# EAGLE design board_v1 (EAGLE 8.5.0)
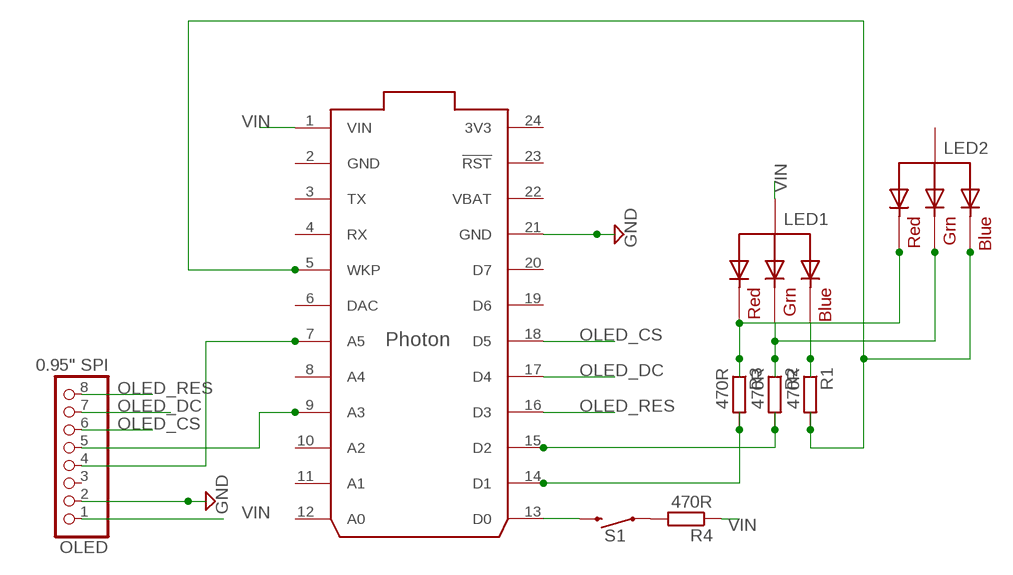
[diagram p0: schematic, sheet 1]

## Parts
LED1  RGBLED_CA-5MM  [LED5MMRGB]
LED2  RGBLED_CA-5MM  [LED5MMRGB]
OLED  0.95" SPI  PINHD-1X8/90  [1X08/90]
R1  470R  R0204/7  [0204/7]
R2  470R  R0204/7  [0204/7]
R3  470R  R0204/7  [0204/7]
R4  470R  R0204/7  [0204/7]
S1  MOMENTARY-SWITCH-SPST-PTH-12MM  [TACTILE_SWITCH_PTH_12MM]
U$1  PHOTON_SMD  [PHOTON_SMD]

## Nets
GND: OLED.2 U$1.21(GND)
N$1: R4.2 S1.1
N$2: S1.3 U$1.13(D0)
N$3: LED1.4(BLUE) R1.1
N$4: LED1.3(GREEN) LED2.3(GREEN) R2.1
N$5: LED1.1(RED) LED2.1(RED) R3.1
OLED_CLK: OLED.5 U$1.9(A3)
OLED_CS: OLED.6 U$1.18(D5)
OLED_DC: OLED.7 U$1.17(D4)
OLED_DIN: OLED.4 U$1.7(A5)
OLED_RES: OLED.8 U$1.16(D3)
RGB_BLUE: LED2.4(BLUE) R1.2 U$1.5(WKP)
RGB_GREEN: R2.2 U$1.15(D2)
RGB_RED: R3.2 U$1.14(D1)
VIN: LED1.2(VCC) OLED.1 R4.1 U$1.1(VIN)
Unconnected: LED2.2(VCC) OLED.3 U$1.3(TX) U$1.4(RX) U$1.6(DAC) U$1.8(A4) U$1.10(A2) U$1.11(A1) U$1.12(A0) U$1.19(D6) U$1.20(D7) U$1.23(!RST) U$1.25(EN) U$1.26(!SETUP) U$1.27(RGB_RED) U$1.28(RGB_GREEN) U$1.29(RGB_BLUE) U$1.30(USB_D-) U$1.31(USB_D+)

## Power pins joined to a net without a drawn wire
3V3: U$1.24(3V3)
GND: U$1.2(GND)
VBAT: U$1.22(VBAT)

## Library data of the parts
LED1 LED2 = adafruit:RGBLED_CA: RGB LED, common-anode 5MM Staggered pins 5mm Piranha package http://www.ladyada.net/library/pcb/eaglelibrary.html
OLED = pinhead:PINHD-1X8: PIN HEADER
R1-R4 = eagle-ltspice:R: RESISTOR, European symbol; SPICEMODEL: NONE; SPICEPREFIX: R
S1 = SparkFun-Switches:MOMENTARY-SWITCH-SPST: Momentary Switch (Pushbutton) - SPST Normally-open (NO) SPST momentary switches (buttons, pushbuttons). Variants PTH-12MM - 12mm square, through-hole Momentary Pushbutton Switch - 12mm Square <https://www.sparkfun.com/products/9190> (COM-09190) PTH-6.0MM, PTH-6.0MM-KIT - 6.0mm square, through-hole Mini Pushbutton Switch <https://www.sparkfun.com/products/97> (COM-00097) KIT package intended for soldering kit's - only one side of pads' copper is exposed. PTH-RIGHT-ANGLE-KIT - Right-angle, through-hole Right Angle Tactile Button <https://www.sparkfun.com/products/10791> - Used on SparkFun BigTime Watch Kit <https://www.sparkfun.com/products/11734> SMD-12MM - 12mm square, surface-mount Tactile Button - SMD (12mm) <https://www.sparkfun.com/products/12993> (COM-12993) Used on SparkFun PicoBoard <https://www.sparkfun.com/products/11888> SMD-4.5MM - 4.5mm Square Trackball Switch Used on SparkFun Blackberry Trackballer Breakout <https://www.sparkfun.com/products/13169> SMD-4.6MMX2.8MM - 4.60mm x 2.80mm, surface mount Used on SparkFun SAMD21 Mini Breakout <https://www.sparkfun.com/products/13664> SMD-5.2MM, SMD-5.2-REDUNDANT - 5.2mm square, surface-mount Mini Pushbutton Switch - SMD <https://www.sparkfun.com/products/8720> (COM-08720) Used on Arduino Pro Mini <https://www.sparkfun.com/products/11114> REDUNDANT package connects both switch circuits together SMD-6.0X3.5MM - 6.0 x 3.5mm, surface mount Momentary Reset Switch SMD <https://www.sparkfun.com/products/8229> (COM-08229) SMD-6.2MM-TALL - 6.2mm square, surface mount Tactile Button - SMD (6mm) <https://www.sparkfun.com/products/12992> Used on SparkFun Digital Sandbox <https://www.sparkfun.com/products/12651> SMD-RIGHT-ANGLE - Right-angle, surface mount Used on SparkFun Block for Intel® Edison - Arduino <https://www.sparkfun.com/products/13036>; PROD_ID: SWCH-09185; SF_SKU: COM-09190
U$1 = Particle-Devices:PHOTON_SMD: Particle Photon (without headers) WiFi development board footprint - designed to be surface mounted with 7 extra exposed pads on the bottom of the board which include, 3 RGB LED outputs, /SETUP, EN (3.3V SMPS enable input), USB D+ and USB D-.

## Board
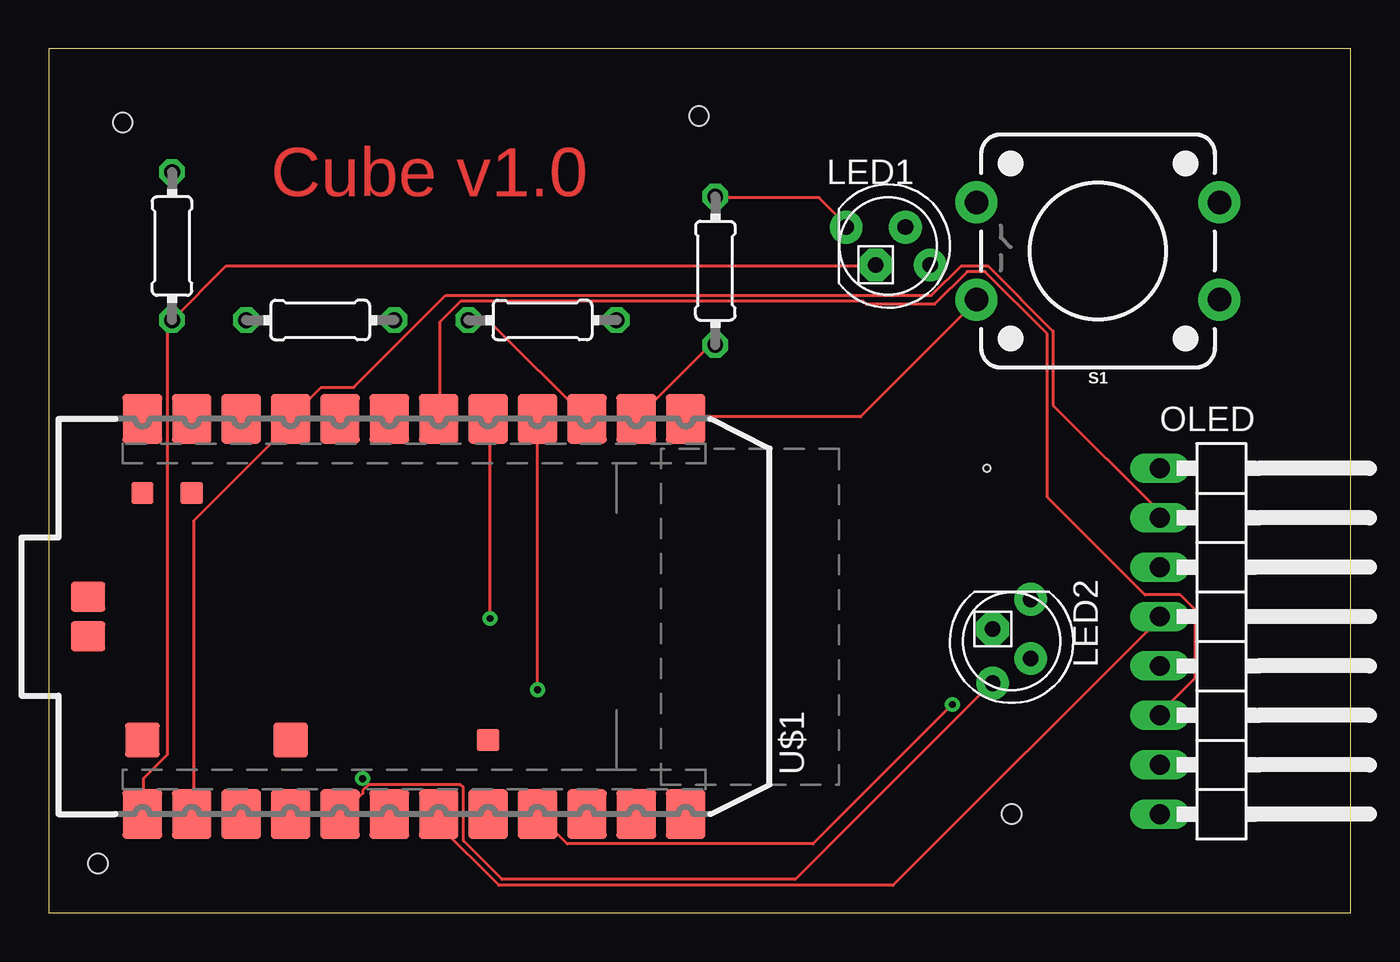
[diagram p1: board, top side]
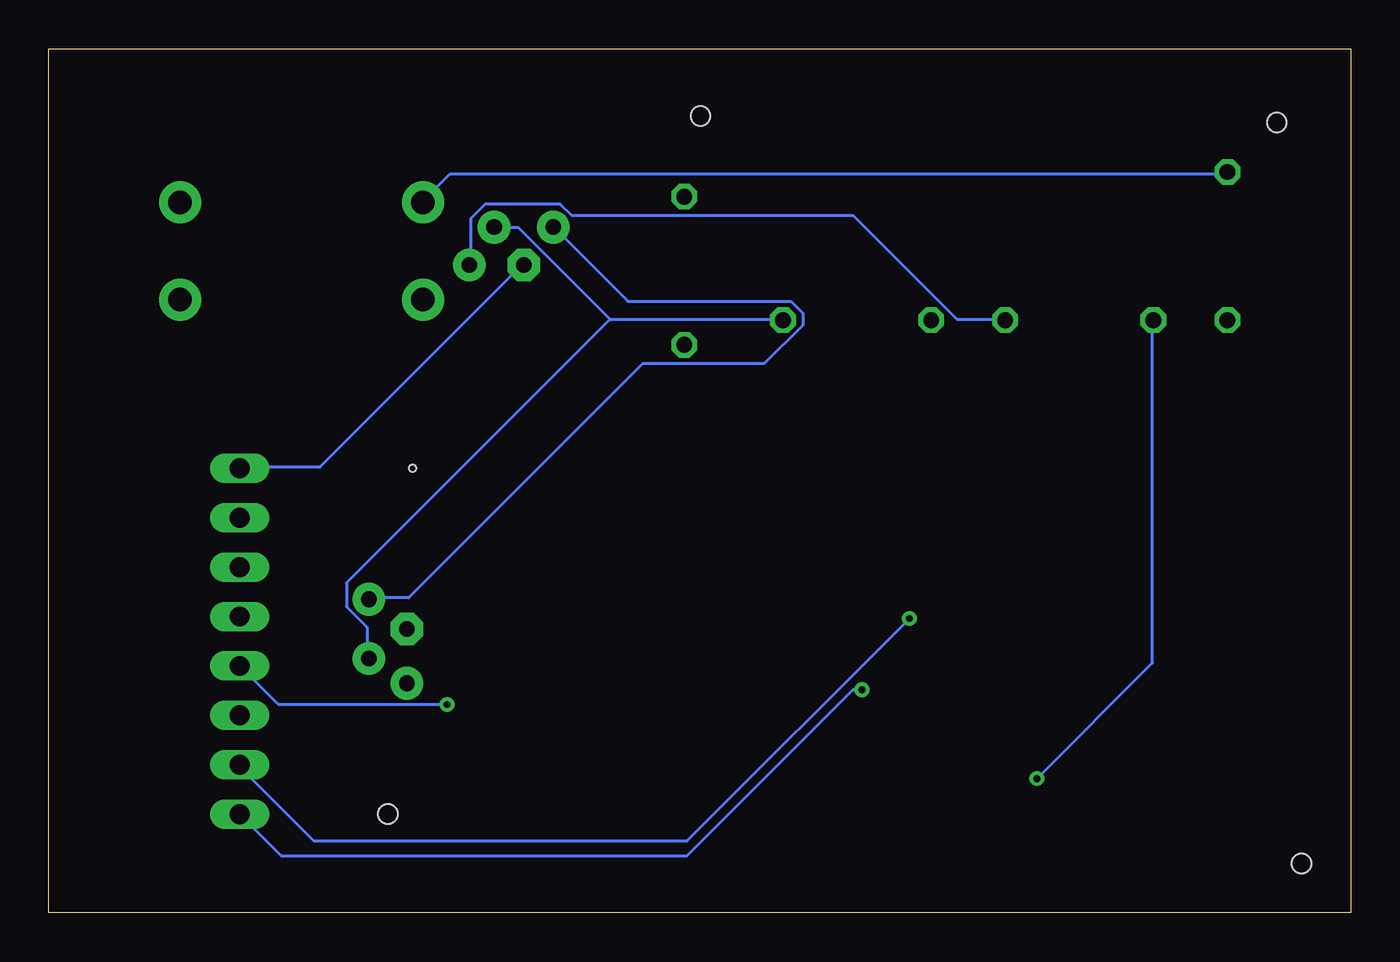
[diagram p2: board, bottom side, seen from below]

Size 66.98 x 44.44 mm. Coordinates in mm from the lower left corner, seen from the top.
Outline: 0,0 66.98,0 66.98,44.44 0,44.44 0,0
Copper layers (1*16): Top 0.035mm / dielectric 1.5mm / Bottom 0.035mm
Design rules "default": minimum track width 6mil, minimum drill 0.35mm, track to track 6mil, track to pad 6mil, pad to pad 6mil, via to via 6mil, smd to smd 6mil, copper to edge 40mil, drill to drill 6mil, minimum pad ring 10mil, minimum via ring 8mil, stop-mask expansion 4mil, vias tented up to drill 0mil, thermal gap 10mil
Holes 1 mm at 3.81,40.64 33.45,40.97 49.53,5.08 2.54,2.54
Holes 0.35 mm at 48.26,22.86

### Footprints (pad centres in the part's own frame; a part is rotated, then mirrored left to right if it is on the bottom)
LED5MMRGB = drill 0.8 pad 1.676: 1 -2.159,0.968; 3 0.889,0.968; 4 2.159,-0.968 | drill 0.8 pad 1.676 octagon: 2 -0.635,-0.968
1X08/90 = drill 1.016 long: 1 -8.89,-3.81; 2 -6.35,-3.81; 3 -3.81,-3.81; 4 -1.27,-3.81; 5 1.27,-3.81; 6 3.81,-3.81; 7 6.35,-3.81; 8 8.89,-3.81
0204/7 = drill 0.813 octagon: 1 -3.81,0; 2 3.81,0
TACTILE_SWITCH_PTH_12MM = drill 1.2 pad 2.159: 1 6.25,-2.5; 2 -6.25,-2.5; 3 6.25,2.5; 4 -6.25,2.5
PHOTON_SMD = smd 2.54 x 2.032: 1 0,33.02; 2 0,30.48; 3 0,27.94; 4 0,25.4; 5 0,22.86; 6 0,20.32; 7 0,17.78; 8 0,15.24; 9 0,12.7; 10 0,10.16; 11 0,7.62; 12 0,5.08; 13 20.32,5.08; 14 20.32,7.62; 15 20.32,10.16; 16 20.32,12.7; 17 20.32,15.24; 18 20.32,17.78; 19 20.32,20.32; 20 20.32,22.86; 21 20.32,25.4; 22 20.32,27.94; 23 20.32,30.48; 24 20.32,33.02 | smd 1.778 x 1.778: 25 3.81,33.02; 26 3.81,25.4 | smd 1.143 x 1.143: 27 3.81,15.24; 28 16.51,30.48; 29 16.51,33.02 | smd 1.524 x 1.778: 30 11.176,35.814; 31 9.144,35.814

### Placement (x,y rotation side)
LED1  43.18,34.29 0 top
LED2  49.53,13.97 270 top
OLED  60.96,13.97 270 top
R1  13.97,30.48 180 top
R2  25.4,30.48 180 top
R3  34.29,33.02 270 top
R4  6.35,34.29 90 top
S1  53.98,34.04 180 top
U$1  37.85,5.08 90 top

### Tracks (layer width: path | path; a pad name or v marks a point on that pad's centre or on a via)
GND
  Top 0.152: U$1.2 7.47,5.08 7.47,20.17 12.34,25.04 12.34,25.35 U$1.21 12.5,25.5 14.02,27.03 15.7,27.03 20.42,31.75 45.41,31.75 46.94,33.27 48.31,33.27 51.66,29.92 51.66,26.11 57.15,20.62 OLED.2
N$1
  Bottom 0.152: R4.2 6.4,38 46.33,38 47.7,36.63 S1.1
N$2
  Top 0.152: U$1.13 32.77,25.5 41.76,25.5 47.7,31.45 S1.3
N$3
  Bottom 0.152: R1.1 17.83,30.53 20.27,30.53 25.6,35.87 40.08,35.87 40.69,36.47 44.5,36.47 45.26,35.71 45.26,33.43 LED1.4
N$4
  Bottom 0.152: 38.1,30.53 29.26,30.53 R2.1 | 38.1,30.53 42.82,35.26 44.04,35.26 LED1.3 | 38.1,30.53 51.66,16.97 51.66,15.75 50.6,14.68 50.6,13.16 LED2.3
N$5
  Top 0.152: R3.1 34.29,36.78 39.62,36.78 41,35.41 LED1.1
  Bottom 0.152: LED2.1 50.44,16.2 48.46,16.2 36.42,28.24 30.18,28.24 28.19,30.23 28.19,30.84 28.8,31.45 37.19,31.45 41,35.26 LED1.1
OLED_CLK  (via drill 0.35)
  Top 0.152: U$1.9 26.67,3.56 39.32,3.56 v46.48,10.72
  Bottom 0.152: v46.48,10.72 55.17,10.72 OLED.5
OLED_CS
  Top 0.152: U$1.18 20.12,25.5 20.12,30.38 21.18,31.45 41.91,31.45 42.06,31.29 45.57,31.29 47.24,32.97 48.16,32.97 51.36,29.77 51.36,21.39 56.39,16.36 58.22,16.36 58.98,15.6 58.98,12.09 57.15,10.26 OLED.6
OLED_DC  (via drill 0.35)
  Top 0.152: v22.71,15.14 22.71,25.35 U$1.17
  Bottom 0.152: v22.71,15.14 34.14,3.71 53.34,3.71 57.15,7.52 OLED.7
OLED_DIN
  Top 0.152: U$1.7 20.12,5.08 20.12,4.47 23.16,1.42 43.43,1.42 57.15,15.14 OLED.4
OLED_RES  (via drill 0.35)
  Top 0.152: v25.15,11.48 U$1.16
  Bottom 0.152: v25.15,11.48 25.6,11.48 34.14,2.95 55.02,2.95 OLED.8
RGB_BLUE  (via drill 0.35)
  Top 0.152: 16.46,6.6 16.15,6.3 16.15,6.15 15.09,5.08 U$1.5 | 16.46,6.6 21.18,6.6 21.34,6.45 21.34,3.71 23.32,1.73 38.41,1.73 48.46,11.79 LED2.4 | 16.46,6.6 v16.15,6.91
  Bottom 0.152: v16.15,6.91 10.21,12.85 10.21,30.38 R1.2
RGB_GREEN
  Top 0.152: U$1.15 22.71,30.38 21.64,30.38 R2.2
RGB_RED
  Top 0.152: U$1.14 33.98,29.16 34.29,29.16 R3.2
VIN
  Top 0.152: U$1.1 4.88,5.08 4.88,6.91 6.1,8.13 6.1,30.23 R4.1 9.14,33.27 42.52,33.27 LED1.2
  Bottom 0.152: OLED.1 57.15,22.91 53.03,22.91 42.67,33.27 LED1.2

### Text on the board
Top: Cube v1.0